# EAGLE design H3_SWPad_Small_Rev_3 (EAGLE 7.6.0)
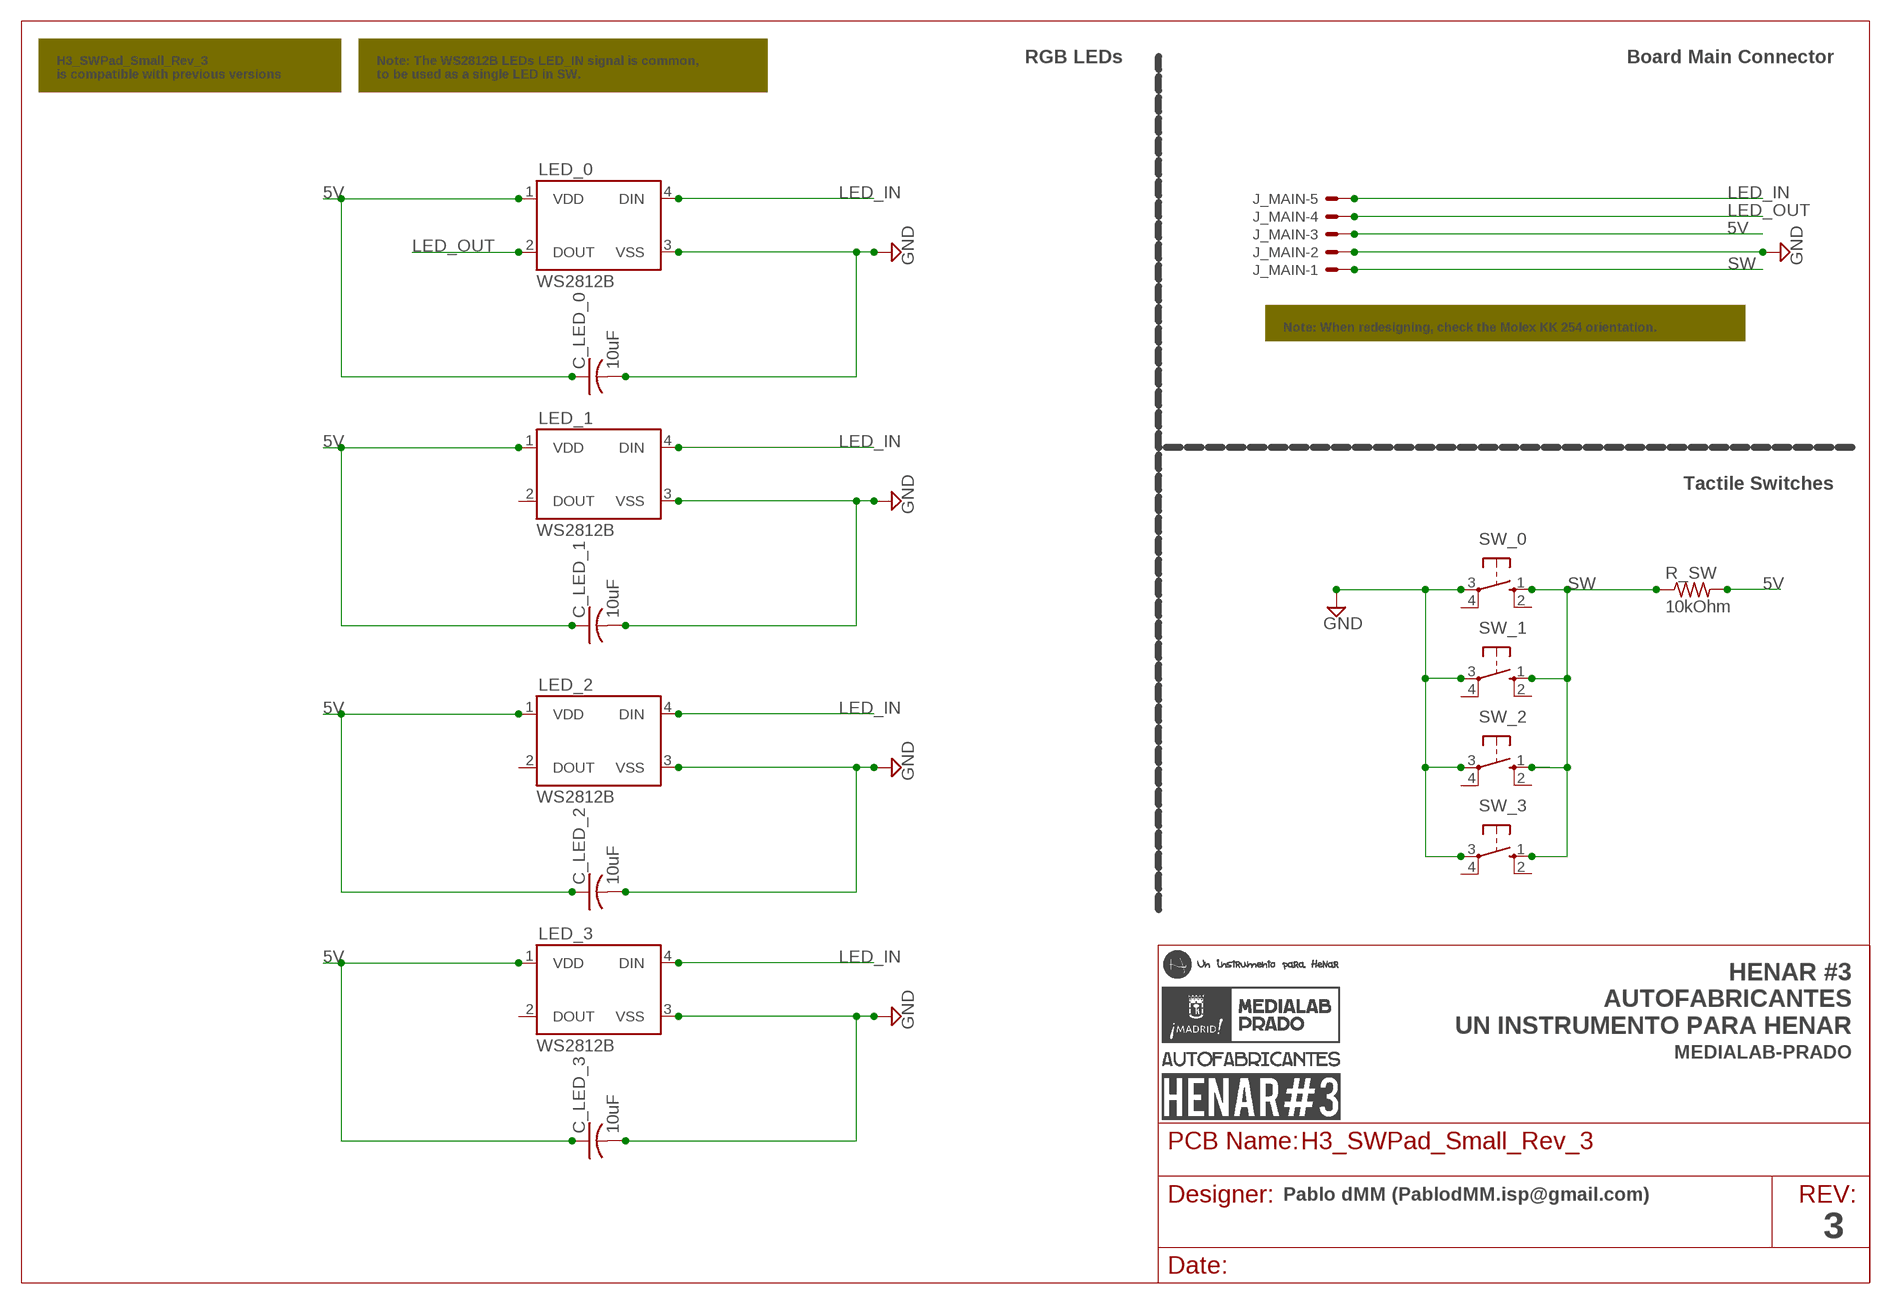
[diagram p0: schematic, sheet 1]

## Parts
C_LED_0  10uF  C-USC1206K  [C1206K]
C_LED_1  10uF  C-USC1206K  [C1206K]
C_LED_2  10uF  C-USC1206K  [C1206K]
C_LED_3  10uF  C-USC1206K  [C1206K]
J_MAIN  22-05-7058-05  [7395-05]
LED_0  WS2812B  [WS2812B]
LED_1  WS2812B  [WS2812B]
LED_2  WS2812B  [WS2812B]
LED_3  WS2812B  [WS2812B]
R_SW  10kOhm  R-US_R1206W  [R1206W]
SW_0  10-XX  [B3F-10XX]
SW_1  10-XX  [B3F-10XX]
SW_2  10-XX  [B3F-10XX]
SW_3  10-XX  [B3F-10XX]

## Nets
5V: C_LED_0.1 C_LED_1.1 C_LED_2.1 C_LED_3.1 J_MAIN.3 LED_0.1(VDD) LED_1.1(VDD) LED_2.1(VDD) LED_3.1(VDD) R_SW.2
GND: C_LED_0.2 C_LED_1.2 C_LED_2.2 C_LED_3.2 J_MAIN.2 LED_0.3(VSS) LED_1.3(VSS) LED_2.3(VSS) LED_3.3(VSS) SW_0.3(P) SW_1.3(P) SW_2.3(P) SW_3.3(P)
LED_IN: J_MAIN.5 LED_0.4(DIN) LED_1.4(DIN) LED_2.4(DIN) LED_3.4(DIN)
LED_OUT: J_MAIN.4 LED_0.2(DOUT)
SW: J_MAIN.1 R_SW.1 SW_0.1(S) SW_1.1(S) SW_2.1(S) SW_3.1(S)
Unconnected: LED_1.2(DOUT) LED_2.2(DOUT) LED_3.2(DOUT) SW_0.2(S1) SW_0.4(P1) SW_1.2(S1) SW_1.4(P1) SW_2.2(S1) SW_2.4(P1) SW_3.2(S1) SW_3.4(P1)

## Notes on the sheet
- H3_SWPad_Small_Rev_3
  is compatible with previous versions
- Note: The WS2812B LEDs LED_IN signal is common,
  to be used as a single LED in SW.
- RGB LEDs | Board Main Connector
- Note: When redesigning, check the Molex KK 254 orientation.
- Tactile Switches
- HENAR #3
  AUTOFABRICANTES
  UN INSTRUMENTO PARA HENAR
- MEDIALAB-PRADO
- Pablo dMM (PablodMM.isp@gmail.com)
- 3

## Library data of the parts
C_LED_0 C_LED_1-C_LED_3 = adafruit:C-US: CAPACITOR, American symbol
J_MAIN = con-molex:22-?-05: CONNECTOR wire to board 2.54 mm (.1 inch) pitch header; OC_FARNELL: unknown; OC_NEWARK: unknown
LED_0 LED_1-LED_3 = SparkFun-LED:WS2812B: WS2812B - Intelligent control LED integrated light source Technical Specifications: Power Supply Voltage (VDD): 3.5 to 5.3 V Input Voltage (VI): -0.5 to VDD+0.5 V Operating Junction Temperature (Topt): -25°C to +80°C Storage Temperature Range (Tstg): -55°C to +150°C; PROD_ID: DIO-12503
R_SW = adafruit:R-US_: RESISTOR, American symbol
SW_0 SW_1-SW_3 = switch-omron:10-XX: OMRON SWITCH; MPN: B3F-1000; OC_FARNELL: 176432; OC_NEWARK: 36M3542

## Board
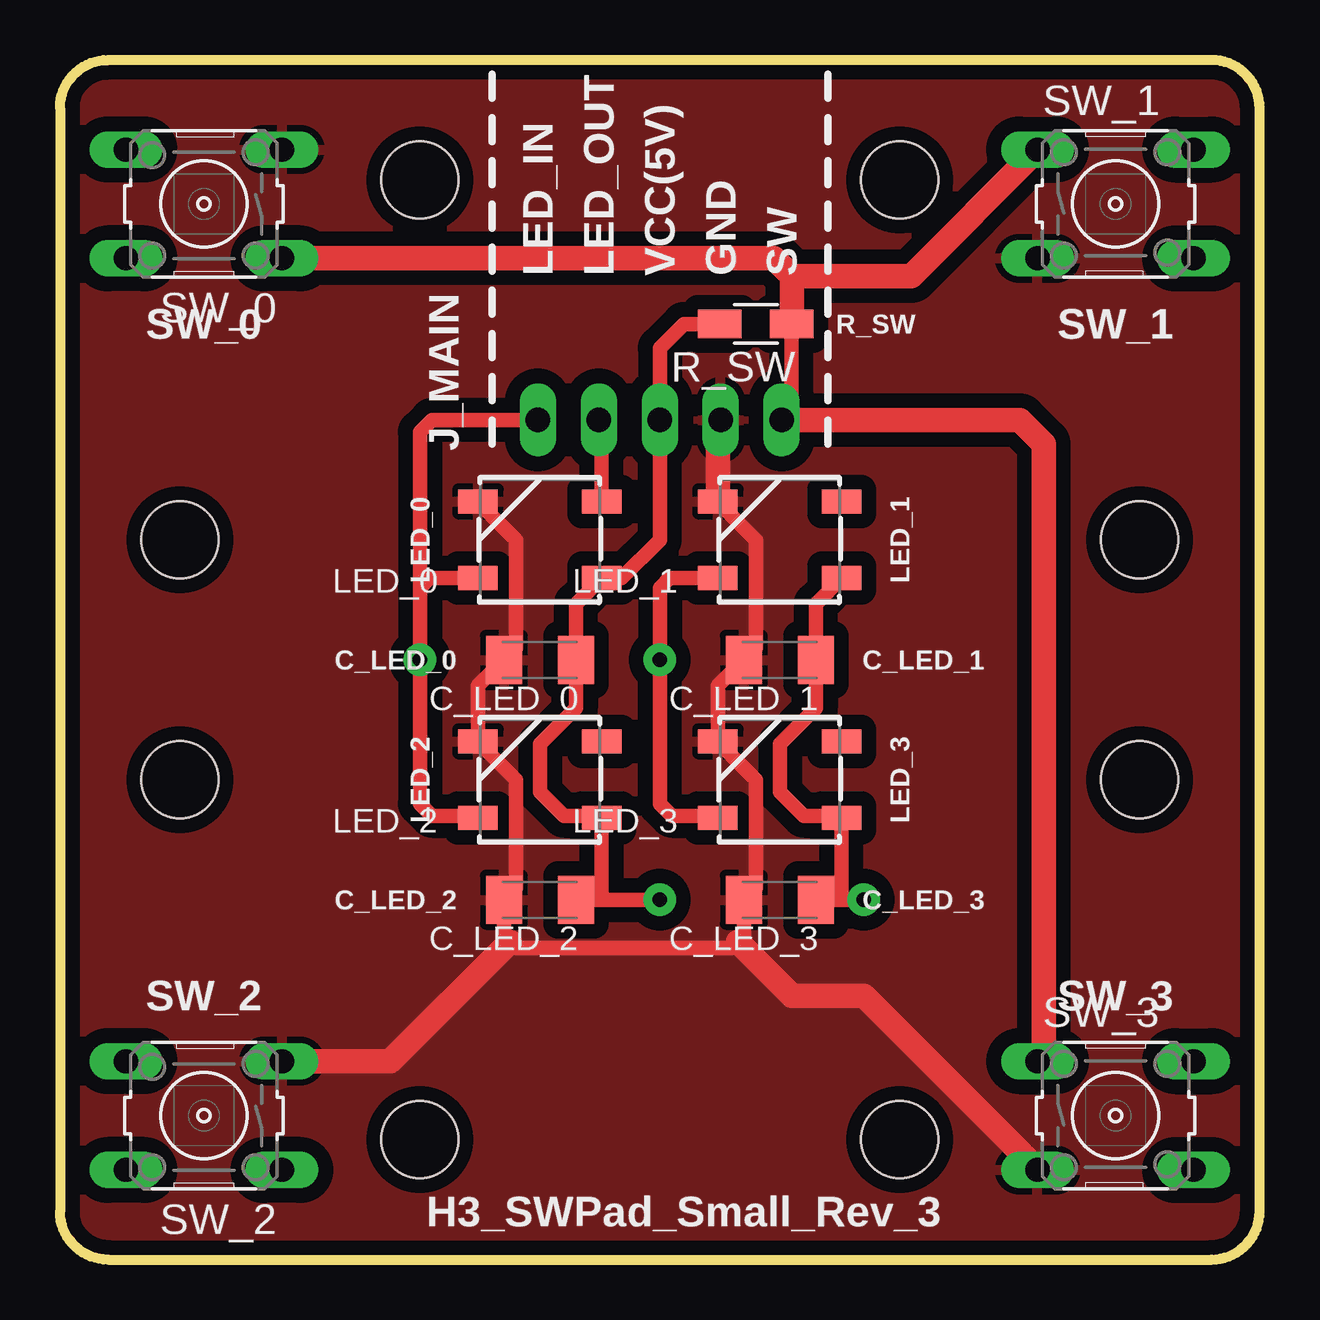
[diagram p1: board, top side]
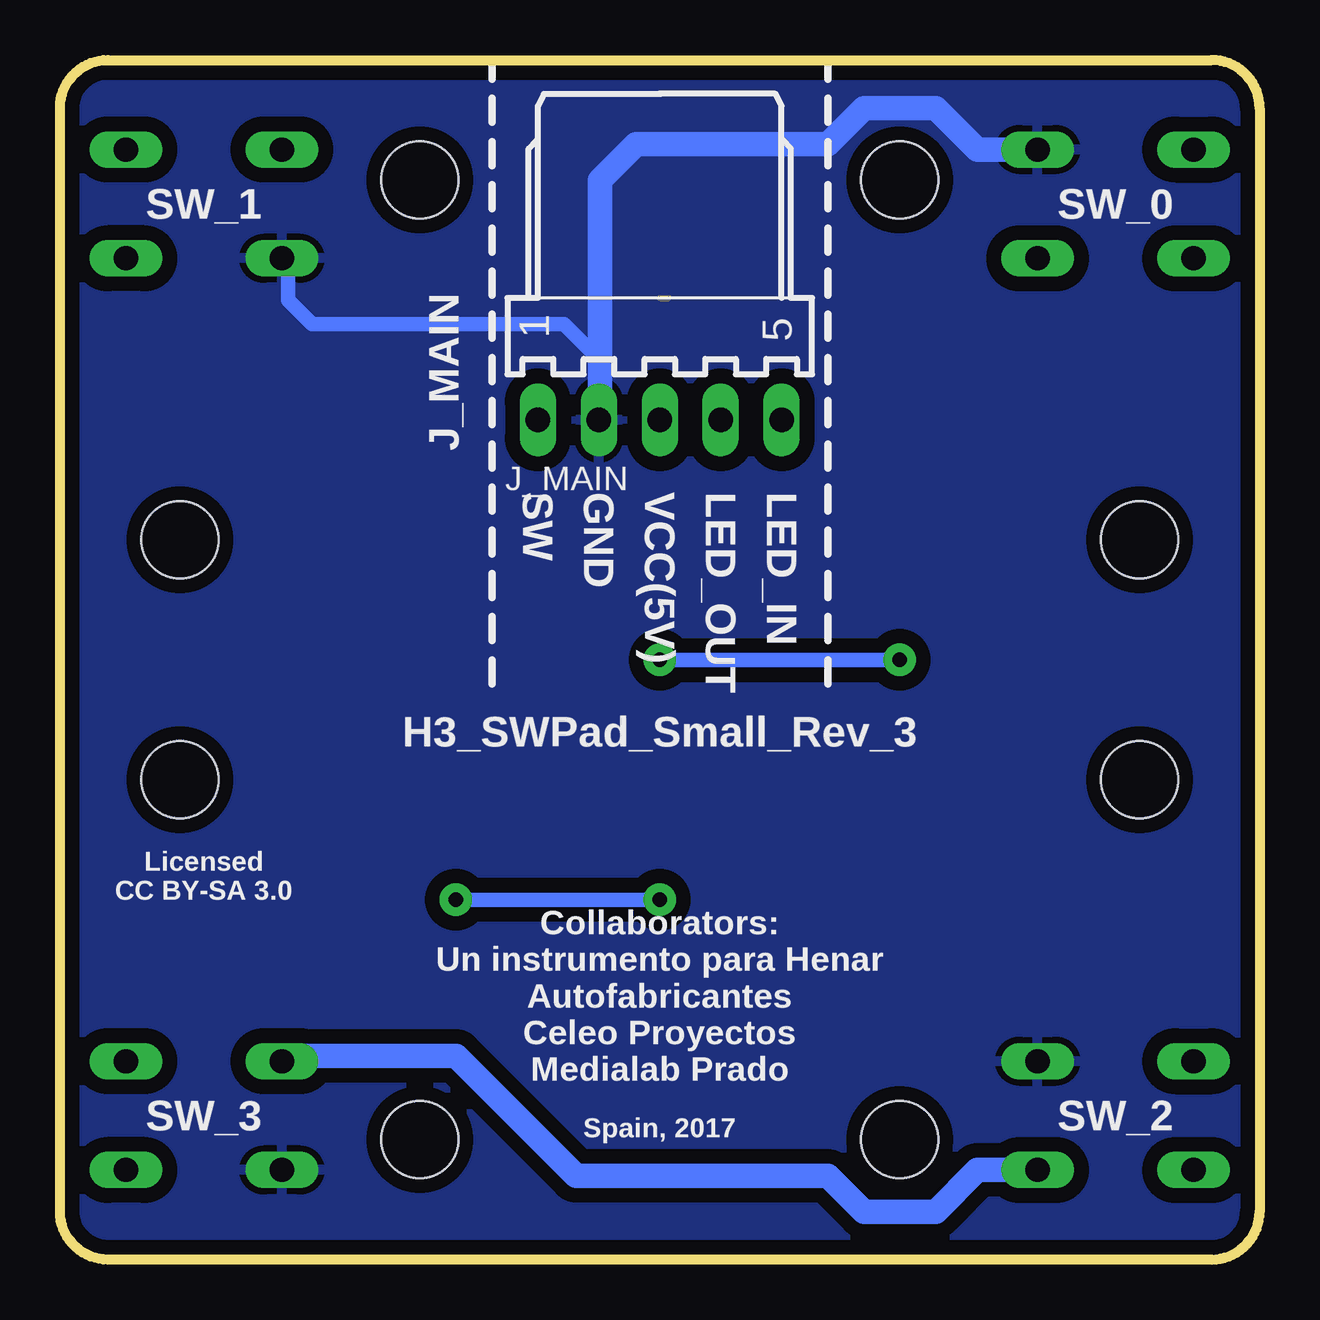
[diagram p2: board, bottom side, seen from below]

Size 50 x 50 mm. Coordinates in mm from the lower left corner, seen from the top.
Outline: 2,0 48,0 arc90 50,2 50,48 arc90 48,50 2,50 arc90 0,48 0,2 arc90 2,0
Copper layers (1*16): Top 0.035mm / dielectric 1.5mm / Bottom 0.035mm
Design rules "default *": minimum track width 12mil, minimum drill 25mil, track to track 15mil, track to pad 15mil, pad to pad 15mil, via to via 15mil, smd to smd 8mil, copper to edge 20mil, drill to drill 8mil, minimum pad ring 10mil, minimum via ring 15mil, stop-mask expansion 4mil, vias tented up to drill 0mil, thermal gap 10mil
Holes 3.2 mm at 5,30 5,20 45,30 45,20 15,5 35,5 35,45 15,45

### Footprints (pad centres in the part's own frame; a part is rotated, then mirrored left to right if it is on the bottom)
C1206K = smd 1.5 x 2: 1 -1.5,0; 2 1.5,0
7395-05 = drill 1.016 long: 1 5.08,0; 2 2.54,0; 3 0,0; 4 -2.54,0; 5 -5.08,0
WS2812B = smd 1.651 x 1: 1 -2.577,1.6; 2 -2.577,-1.6; 3 2.577,-1.6; 4 2.577,1.6
R1206W = smd 1.8 x 1.2: 1 -1.499,0; 2 1.499,0
B3F-10XX = drill 1.016 long: 1 -3.251,2.261; 2 3.251,2.261; 3 -3.251,-2.261; 4 3.251,-2.261

### Placement (x,y rotation side)
C_LED_0  20,25 180 top
C_LED_1  30,25 180 top
C_LED_2  20,15 180 top
C_LED_3  30,15 180 top
J_MAIN  25,35 180 bottom
LED_0  20,30 180 top
LED_1  30,30 180 top
LED_2  20,20 180 top
LED_3  30,20 180 top
R_SW  29,39 180 top
SW_0  6,44 180 top
SW_1  44,44 0 top
SW_2  6,6 180 top
SW_3  44,6 0 top

### Tracks (layer width: path | path; a pad name or v marks a point on that pad's centre or on a via)
5V  (via drill 0.6)
  Top 0.61: C_LED_2.1 22,15 | 22,15 22.58,15 | 22.58,15 LED_2.1 | C_LED_3.1 32.58,15 | 32.58,15 LED_3.1 32.48,18.5 31,18.5 30,19.5 30,21.5 31.5,23 C_LED_1.1 31.5,27.32 LED_1.1 | LED_2.1 22.48,18.5 21,18.5 20,19.5 20,21.5 21.5,23 C_LED_0.1 21.5,27.32 LED_0.1 23.4,28.4 25,30 J_MAIN.3 25,38 26,39 R_SW.2 | LED_2.1 22.58,15.58 22,15 | 22.58,15 v25,15 | v33.5,15 32.58,15
  Bottom 0.61: v25,15 v33.5,15
GND
  Top 0.61: LED_0.3 17.42,31.58 19,30 19,25.5 C_LED_0.2 17.42,23.92 LED_2.3 17.42,21.58 19,20 19,15.5 C_LED_2.2 18.5,13.5 18.75,13.25 19,13 28,13 28.25,13.25 28.5,13.5 C_LED_3.2 29,15.5 29,20 27.42,21.58 LED_3.3 27.42,23.92 C_LED_1.2 29,25.5 29,30 27.42,31.58 LED_1.3
  Top 1.016: SW_2.3 13.76,8.26 18.75,13.25 | SW_3.3 40.75,3.75 33.5,11 30.5,11 28.25,13.25 | LED_1.3 27.42,34.88 J_MAIN.2
  Bottom 0.61: J_MAIN.2 27.54,35.5 27.54,37.54 29,39 39.5,39 40.5,40 40.5,41.49 SW_1.3
  Bottom 1.016: SW_0.3 11.76,46.26 13.5,48 16.5,48 18,46.5 26,46.5 27.5,45 27.5,35.54 27.54,35.5
  pour Top (isolate 0.813): 2,0 48,0 arc90 50,2 50,48 arc90 48,50 2,50 arc90 0,48 0,2 arc90
  pour Bottom (isolate 0.813): 2,0 48,0 arc90 50,2 50,48 arc90 48,50 2,50 arc90 0,48 0,2 arc90
  pour Top (isolate 0.61): 2,0 48,0 arc90 50,2 50,48 arc90 48,50 2,50 arc90 0,48 0,2 arc90
  pour Bottom (isolate 0.61): 0,2 arc90 2,0 48,0 arc90 50,2 50,48 arc90 48,50 2,50 arc90 0,48
LED_IN  (via drill 0.6)
  Top 0.61: LED_0.4 15.4,28.4 15,28 | 15,28 v15,25 15,19 15.5,18.5 17.32,18.5 LED_2.4 | LED_1.4 25.4,28.4 25,28 v25,25 25,19 25.5,18.5 27.32,18.5 LED_3.4 | J_MAIN.5 15.5,35 15,34.5 15,28
  Bottom 0.61: v25,25 v15,25
LED_OUT
  Top 0.61: LED_0.2 22.58,34.88 J_MAIN.4
N$1
  pour Top (isolate 0.813): 2,0 48,0 arc90 50,2 50,48 arc90 48,50 2,50 arc90 0,48 0,2 arc90
N$2
  pour Bottom (isolate 0.813): 2,0 48,0 arc90 50,2 50,48 arc90 48,50 2,50 arc90 0,48 0,2 arc90
N$3
  pour Top (isolate 0.61): 2,0 48,0 arc90 50,2 50,48 arc90 48,50 2,50 arc90 0,48 0,2 arc90
N$4
  pour Bottom (isolate 0.61): 0,2 arc90 2,0 48,0 arc90 50,2 50,48 arc90 48,50 2,50 arc90 0,48
SW
  Top 0.61: J_MAIN.1 30.5,35 R_SW.1
  Top 1.016: SW_0.1 29.76,41.74 30.5,41 | 30.5,41 R_SW.1 | 30.5,41 35.49,41 SW_1.1 | J_MAIN.1 40,35 41,34 41,8.51 SW_3.1
  Bottom 1.016: SW_2.1 11.76,3.74 13.5,2 16.5,2 18,3.5 28.5,3.5 33.5,8.5 40.51,8.5 SW_3.1

### Text on the board
t_Silk: LED_IN / LED_OUT / VCC(5V) / GND / SW | SW_0 | R_SW | SW_1 | J_MAIN | LED_0 | LED_1 | C_LED_0 | C_LED_1 | LED_2 | LED_3 | C_LED_2 | C_LED_3 | SW_2 | SW_3 | H3_SWPad_Small_Rev_3
b_Silk: SW_0 | SW_1 | J_MAIN | LED_IN / LED_OUT / VCC(5V) / GND / SW | H3_SWPad_Small_Rev_3 | Licensed / CC BY-SA 3.0 | Collaborators: / Un instrumento para Henar / Autofabricantes / Celeo Proyectos / Medialab Prado | SW_2 | Spain, 2017 | SW_3